# EAGLE design Adafruit Stemma QT 5 Port Hub (EAGLE 9.6.2)
COMPANY: ADAFRUIT INDUSTRIES; DRAWN: KTOWN; REV: A
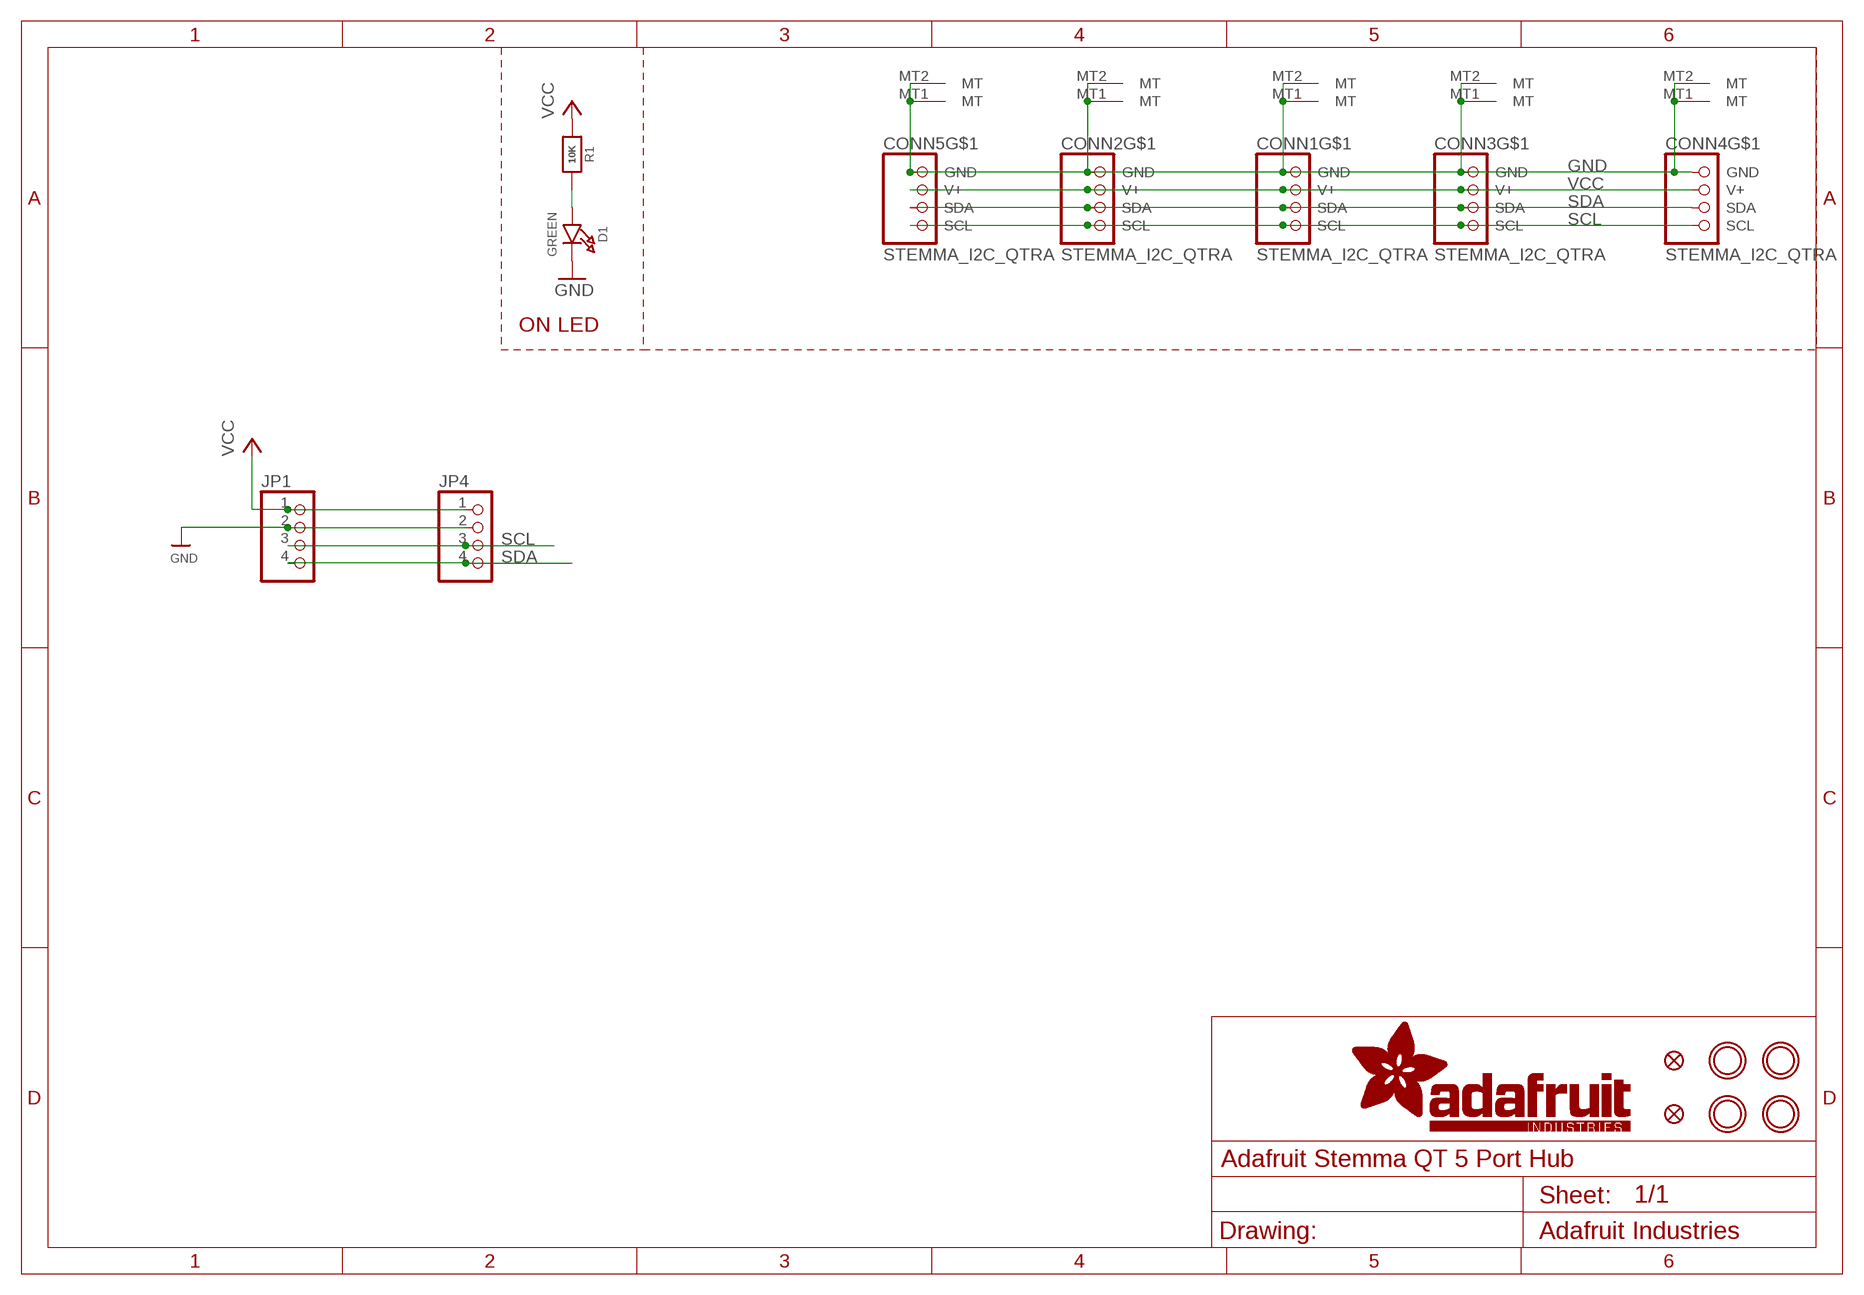
[diagram p0: schematic, sheet 1]

## Parts
CONN1  STEMMA_I2C_QTRA  [JST_SH4_RA]
CONN2  STEMMA_I2C_QTRA  [JST_SH4_RA]
CONN3  STEMMA_I2C_QTRA  [JST_SH4_RA]
CONN4  STEMMA_I2C_QTRA  [JST_SH4_RA]
CONN5  STEMMA_I2C_QTRA  [JST_SH4_RA]
D1  GREEN  LED0603_NOOUTLINE  [CHIPLED_0603_NOOUTLINE]
FID3  FIDUCIAL_1MM  [FIDUCIAL_1MM]
FID4  FIDUCIAL_1MM  [FIDUCIAL_1MM]
JP1  HEADER-1X476MIL  [1X04_ROUND_76]
JP4  HEADER-1X476MIL  [1X04_ROUND_76]
R1  10K  RESISTOR_0603_NOOUT  [0603-NO]
U$1  MOUNTINGHOLE2.5  [MOUNTINGHOLE_2.5_PLATED]
U$17  MOUNTINGHOLE2.5  [MOUNTINGHOLE_2.5_PLATED]
U$19  MOUNTINGHOLE2.5  [MOUNTINGHOLE_2.5_PLATED]
U$21  MOUNTINGHOLE2.5  [MOUNTINGHOLE_2.5_PLATED]

## Nets
GND [highpower]: CONN1.1(GND) CONN1.MT1(MT) CONN1.MT2(MT) CONN2.1(GND) CONN2.MT1(MT) CONN2.MT2(MT) CONN3.1(GND) CONN3.MT1(MT) CONN3.MT2(MT) CONN4.1(GND) CONN4.MT1(MT) CONN4.MT2(MT) CONN5.1(GND) CONN5.MT1(MT) CONN5.MT2(MT) D1.C JP1.2 JP4.2
N$1: D1.A R1.2
SCL: CONN1.4(SCL) CONN2.4(SCL) CONN3.4(SCL) CONN4.4(SCL) CONN5.4(SCL) JP1.3 JP4.3
SDA: CONN1.3(SDA) CONN2.3(SDA) CONN3.3(SDA) CONN4.3(SDA) CONN5.3(SDA) JP1.4 JP4.4
VCC [highpower]: CONN1.2(V+) CONN2.2(V+) CONN3.2(V+) CONN4.2(V+) CONN5.2(V+) JP1.1 JP4.1 R1.1

## Notes on the sheet
- ON LED

## Library data of the parts
CONN1-CONN5 = adafruit_electromech:STEMMA_I2C; LCSC: C145961
D1 = microbuilder:LED: LED 0603 - 0603 Surface Mount Package 2mA: Green LED - Low Power (3.9mcd, 2ma, 1.7Vf) - Digikey: 475-2709-2-ND Orange LED - Low Power (9.8mcd, 2ma, 1.8Vf) - Digikey: 475-1194-2-ND Red LED - Low Power (5mcd, 2ma, 1.8Vf) - Digikey: 475-1195-2-ND Yellow LED - Low Power (7mcd, 2ma, 1.8Vf) - Digikey: 475-1196-2-ND 5mA: Blue LED - Low Power (17mcd, 5ma, 2.9Vf) - Digikey: LNJ937W8CRACT-ND 0805 - 0805 Surface Mount Package 2mA: Red LED (8.8mcd, 2mA, 1.8Vf, Clear) - Low Power [Digikey: 475-2510-1-ND] Green LED (5mcd, 2mA, 1.8Vf, Clear) - Low Power [Digikey: 475-2730-1-ND] Yellow LED (11.3mcd, 2mA, 1.8Vf, Clear) - Low Power [Digikey: 475-2555-1-ND] 20mA: Red LED (104mcd, 20mA, Diffused) - LS R976 [Digikey: 475-1278-6-ND] Red LED (12mcd, 20mA, 2.0Vf, Clear) - APT2012EC [Digikey: 754-1128-1-ND] Green LED (15mcd, 20mA, 2.2Vf, Clear) - APT2012GC [Digikey: 754-1131-1-ND] Orange LED (160mcd, 20mA, 2.1Vf, Clear) - APT2012SECK [Digikey: 754-1130-1-ND] 1206 - 1206 Surface Mount Package Green LED (26mcd, 20mA, Diffused) - LG N971 [Digikey: 475-1407-6-ND] Red LED (15mcd, 20mA, Diffused) - LH N974 [Digikey: 475-1416-6-ND] Cree - Cree High-Power Surface Mount LEDs XPEBWT-L1-0000-00D50 - White 111lm 350mA 2.9Vf 6200K 110° XTEAWT-00-0000-00000LEE3 - White 114lm 350mA 2.85Vf 5000K 115° Everlight - Everlight 45-21 Series Surface Mount LEDs 45-21/QK2C-B2832AC2CB2/2T - Warm White 2000mcd 20mA 3.25Vf 3050K 120° 45-21/LK2C-B38452C4CB2/2T - Nuetral White 2000mcd 20mA 3.25Vf 4150K 120° 45-21/LK2C-B50634C6CB2/2T - Cold White 2200mcd 20mA 3.25Vf 5650K 120° PLCC2 Reverse Mount LS T77K-J1L2-1-0-2-R18-Z - Red 11.25mcd 2mA 1.8Vf 630nm 120° LO T77K-L1M2-24-Z - Orange 19.6mcd 2mA 1.8Vf 606nm 120° LY T77K-K2M1-26-Z - Yellow 15.7mcd 2mA 1.8Vf 587nm 120°; JLC_ROTATION: 270
FID3 FID4 = microbuilder:FIDUCIAL: Fiducial Alignment Points Various fiducial points for machine vision alignment.; BOM: EXCLUDE
JP1 JP4 = microbuilder:HEADER-1X4: PIN HEADER
R1 = microbuilder:RESISTOR: Resistors For new designs, use the packages preceded by an '_' character since they are more reliable: The following footprints should be used on most boards: _0402 - Standard footprint for regular board layouts _0603 - Standard footprint for regular board layouts _0805 - Standard footprint for regular board layouts _1206 - Standard footprint for regular board layouts For extremely tight-pitch boards where space is at a premium, the following 'micro-pitch' footprints can be used (smaller pads, no silkscreen outline, etc.): _0402MP - Micro-pitch footprint for very dense/compact boards _0603MP - Micro-pitch footprint for very dense/compact boards _0805MP - Micro-pitch footprint for very dense/compact boards _1206MP - Micro-pitch footprint for very dense/compact boards
U$1 U$17 U$19 U$21 = microbuilder:MOUNTINGHOLE: Mounting Hole For #2 screws (0.086"/2.18mm width, 0.094"/2.4mm hole) use 2.5mm; BOM: EXCLUDE

## Net classes
1 highpower: width 0.305 mm, drill 0.483 mm
2 lowpower: width 0.254 mm, drill 0.483 mm

## Board
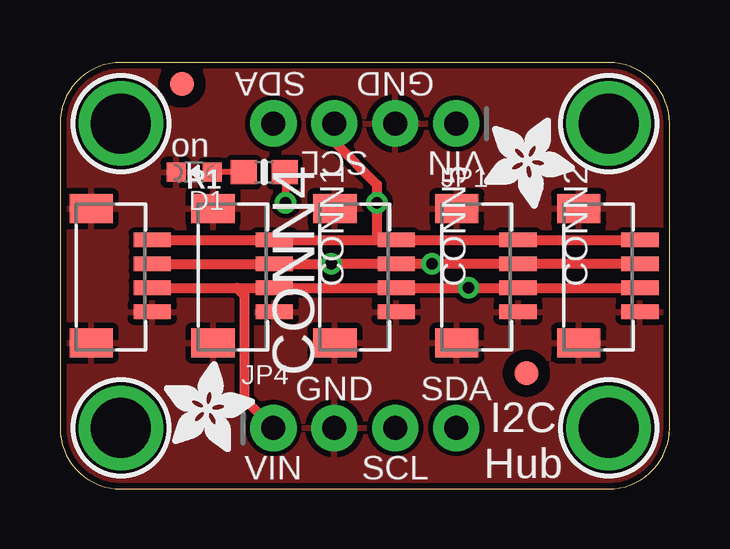
[diagram p1: board, top side]
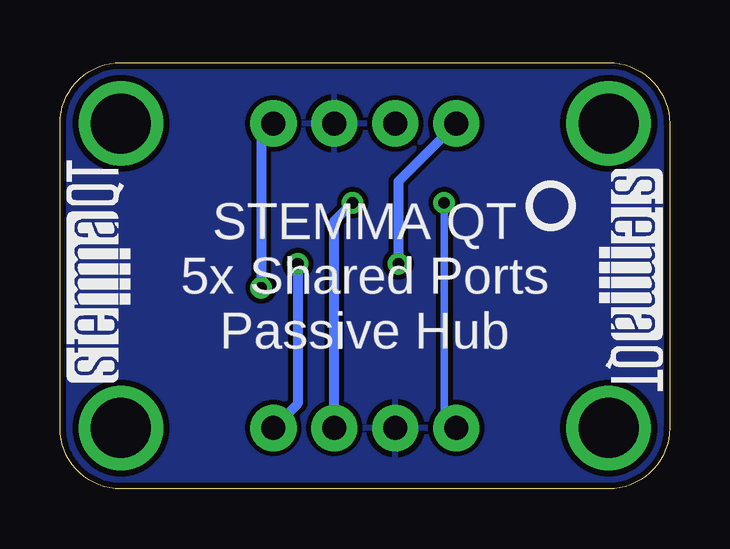
[diagram p2: board, bottom side, seen from below]

Size 25.4 x 17.78 mm. Coordinates in mm from the lower left corner, seen from the top.
Outline: 0,15.24 0,2.54 arc90 2.54,0 22.86,0 arc90 25.4,2.54 25.4,15.24 arc90 22.86,17.78 2.54,17.78 arc90 0,15.24
Copper layers (1*16): Top 0.035mm / dielectric 1.5mm / Bottom 0.035mm
Design rules "adafruit *": minimum track width 8mil, minimum drill 15.5mil, track to track 8mil, track to pad 8mil, pad to pad 8mil, via to via 8mil, smd to smd 8mil, copper to edge 10mil, drill to drill 8mil, minimum pad ring 10mil, minimum via ring 8mil, stop-mask expansion 2mil, vias tented up to drill 20mil, thermal gap 10mil

### Footprints (pad centres in the part's own frame; a part is rotated, then mirrored left to right if it is on the bottom)
JST_SH4_RA = smd 0.6 x 1.55: 1 1.5,0.924; 2 0.5,0.924; 3 -0.5,0.924; 4 -1.5,0.924 | smd 1.2 x 1.8: MT1 -2.8,-1.624; MT2 2.8,-1.624
CHIPLED_0603_NOOUTLINE = smd 0.8 x 0.8: A 0,-0.75; C 0,0.75
FIDUCIAL_1MM = smd 1 x 1: 1 0,0
1X04_ROUND_76 = drill 1 pad 1.93: 1 -3.81,0; 2 -1.27,0; 3 1.27,0; 4 3.81,0
0603-NO = smd 1.075 x 1: 1 -0.85,0; 2 0.85,0
MOUNTINGHOLE_2.5_PLATED = drill 2.5 pad 3.2: P$1 0,0

### Placement (x,y rotation side)
CONN1  8,8.89 270 top
CONN2  18.16,8.89 270 top
CONN3  23.24,8.89 270 top
CONN4  2.92,8.89 270 top
CONN5  13.08,8.89 270 top
D1  5.59,13.21 90 top
FID3  19.43,4.83 0 top
FID4  5.08,16.89 0 top
JP1  12.7,15.24 180 top
JP4  12.7,2.54 0 top
R1  8.51,13.21 180 top
U$1  2.54,15.24 0 top
U$2  [ADAFRUIT_3.5MM]  4.32,1.52 0 top
U$3  [ADAFRUIT_3.5MM]  17.65,15.49 270 top
U$17  22.86,15.24 0 top
U$19  2.54,2.54 0 top
U$21  22.86,2.54 0 top
U$25  [PCBFEAT-REV-040]  4.95,11.81 0 bottom
U$30  [STEMMAQT]  22.48,4.45 90 bottom
U$31  [STEMMAQT]  2.92,13.34 270 bottom

### Tracks (layer width: path | path; a pad name or v marks a point on that pad's centre or on a via)
GND
  pour Top: 0,17.78 25.4,17.78 25.4,0 0,0
  pour Bottom: 0,17.78 25.4,17.78 25.4,0 0,0
N$1
  Top 0.254: R1.2 D1.A
SCL  (via drill 0.48)
  Top 0.406: CONN4.4 CONN1.4 13.21,10.39 | 13.21,10.39 CONN5.4 CONN2.4 CONN3.4 | JP1.3 11.43,14.48 13.21,12.7 v13.21,11.94 13.21,10.39
  Bottom 0.406: JP4.3 13.97,11.18 v13.21,11.94
SDA  (via drill 0.48)
  Top 0.406: CONN3.3 CONN2.3 v15.49,9.39 CONN5.3 v11.3,9.39 CONN1.3 CONN4.3
  Bottom 0.406: JP1.4 11.3,12.83 v11.3,9.39 | v15.49,9.39 15.49,3.56 JP4.4
VCC  (via drill 0.48)
  Top 0.305: v9.4,11.94 9.4,13.17 R1.1
  Top 0.406: CONN4.2 7.37,8.39 | 7.37,8.39 CONN1.2 CONN5.2 | CONN5.2 14.47,8.39 14.48,8.38 | CONN5.2 v17.02,8.39 CONN2.2 CONN3.2 | 7.37,8.39 7.68,8.07 7.68,3.75 JP4.1
  Bottom 0.305: v9.4,11.94 9.4,3.05 JP4.1
  Bottom 0.406: JP1.1 17.02,14.73 v17.02,8.39

### Text on the board
tPlace: SDA | GND | on | SCL | VIN | GND | SDA | I2C / Hub | VIN | SCL
bPlace: STEMMA QT / 5x Shared Ports / Passive Hub